# Altium schematic sheet Root.SchDoc
size A4
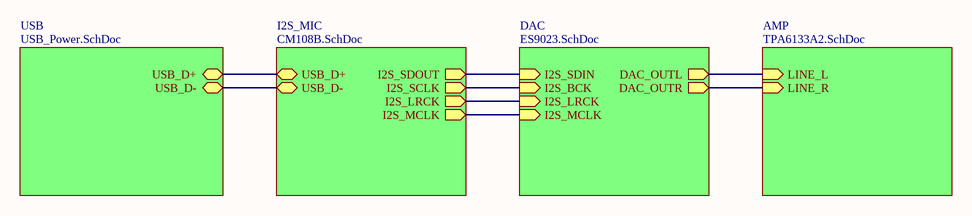
[diagram p0: Root.SchDoc]

## Sub-sheets
AMP = TPA6133A2.SchDoc: LINE_R (in), LINE_L (in)
DAC = ES9023.SchDoc: I2S_MCLK (in), I2S_LRCK (in), DAC_OUTL (out), DAC_OUTR (out), I2S_SDIN (in), I2S_BCK (in)
I2S_MIC = CM108B.SchDoc: USB_D-, I2S_SDOUT (out), USB_D+, I2S_MCLK (out), I2S_LRCK (out), I2S_SCLK (out)
USB = USB_Power.SchDoc: USB_D-, USB_D+

## Nets
(unnamed): sheet USB/USB_D-, sheet I2S_MIC/USB_D-
(unnamed): sheet USB/USB_D+, sheet I2S_MIC/USB_D+
(unnamed): sheet I2S_MIC/I2S_SDOUT, sheet DAC/I2S_SDIN
(unnamed): sheet I2S_MIC/I2S_MCLK, sheet DAC/I2S_MCLK
(unnamed): sheet I2S_MIC/I2S_LRCK, sheet DAC/I2S_LRCK
(unnamed): sheet I2S_MIC/I2S_SCLK, sheet DAC/I2S_BCK
(unnamed): sheet AMP/LINE_R, sheet DAC/DAC_OUTR
(unnamed): sheet AMP/LINE_L, sheet DAC/DAC_OUTL